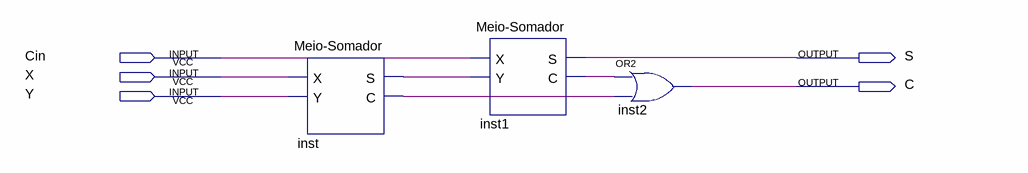
[diagram p0: schematic sheet]
// Quartus schematic Somador-Completo.bdf as structural Verilog: 3 symbols, 5 pins
module \Somador-Completo  (
  input  Cin,
  input  X,
  input  Y,
  output S,
  output C
);

  wire inst1_c, inst_c, inst_s;

  \Meio-Somador  inst (.X(X), .Y(Y), .S(inst_s), .C(inst_c));
  \Meio-Somador  inst1 (.X(Cin), .Y(inst_s), .S(S), .C(inst1_c));
  or inst2 (C, inst1_c, inst_c);
endmodule
